# EAGLE board pds019_main_082_ext (EAGLE 9.6.2), part 1 of 2
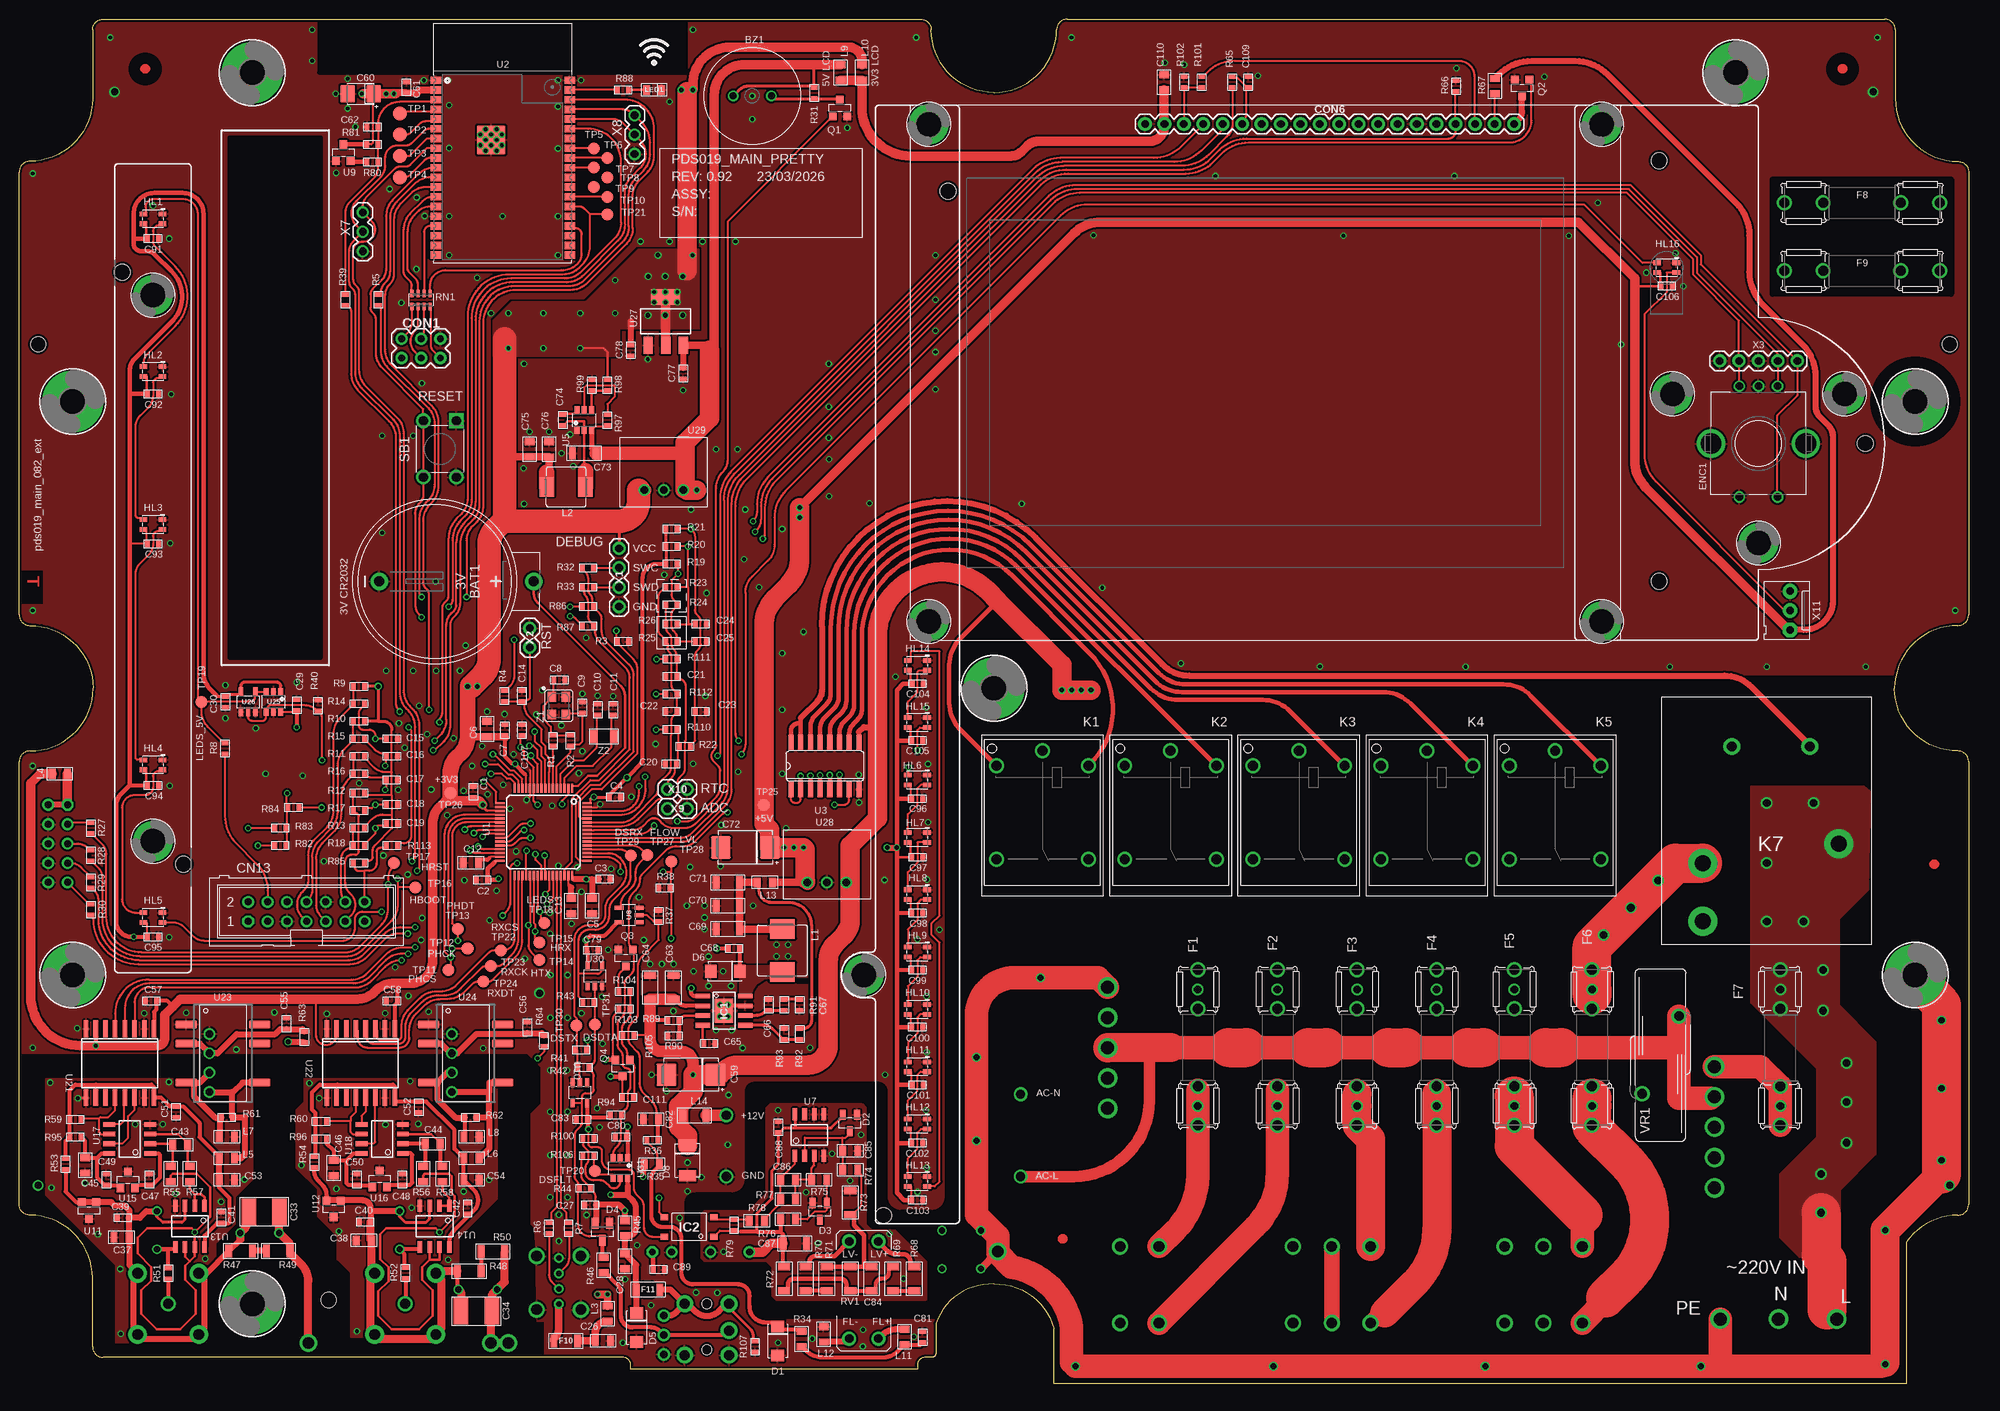
[diagram p7: board, top side]
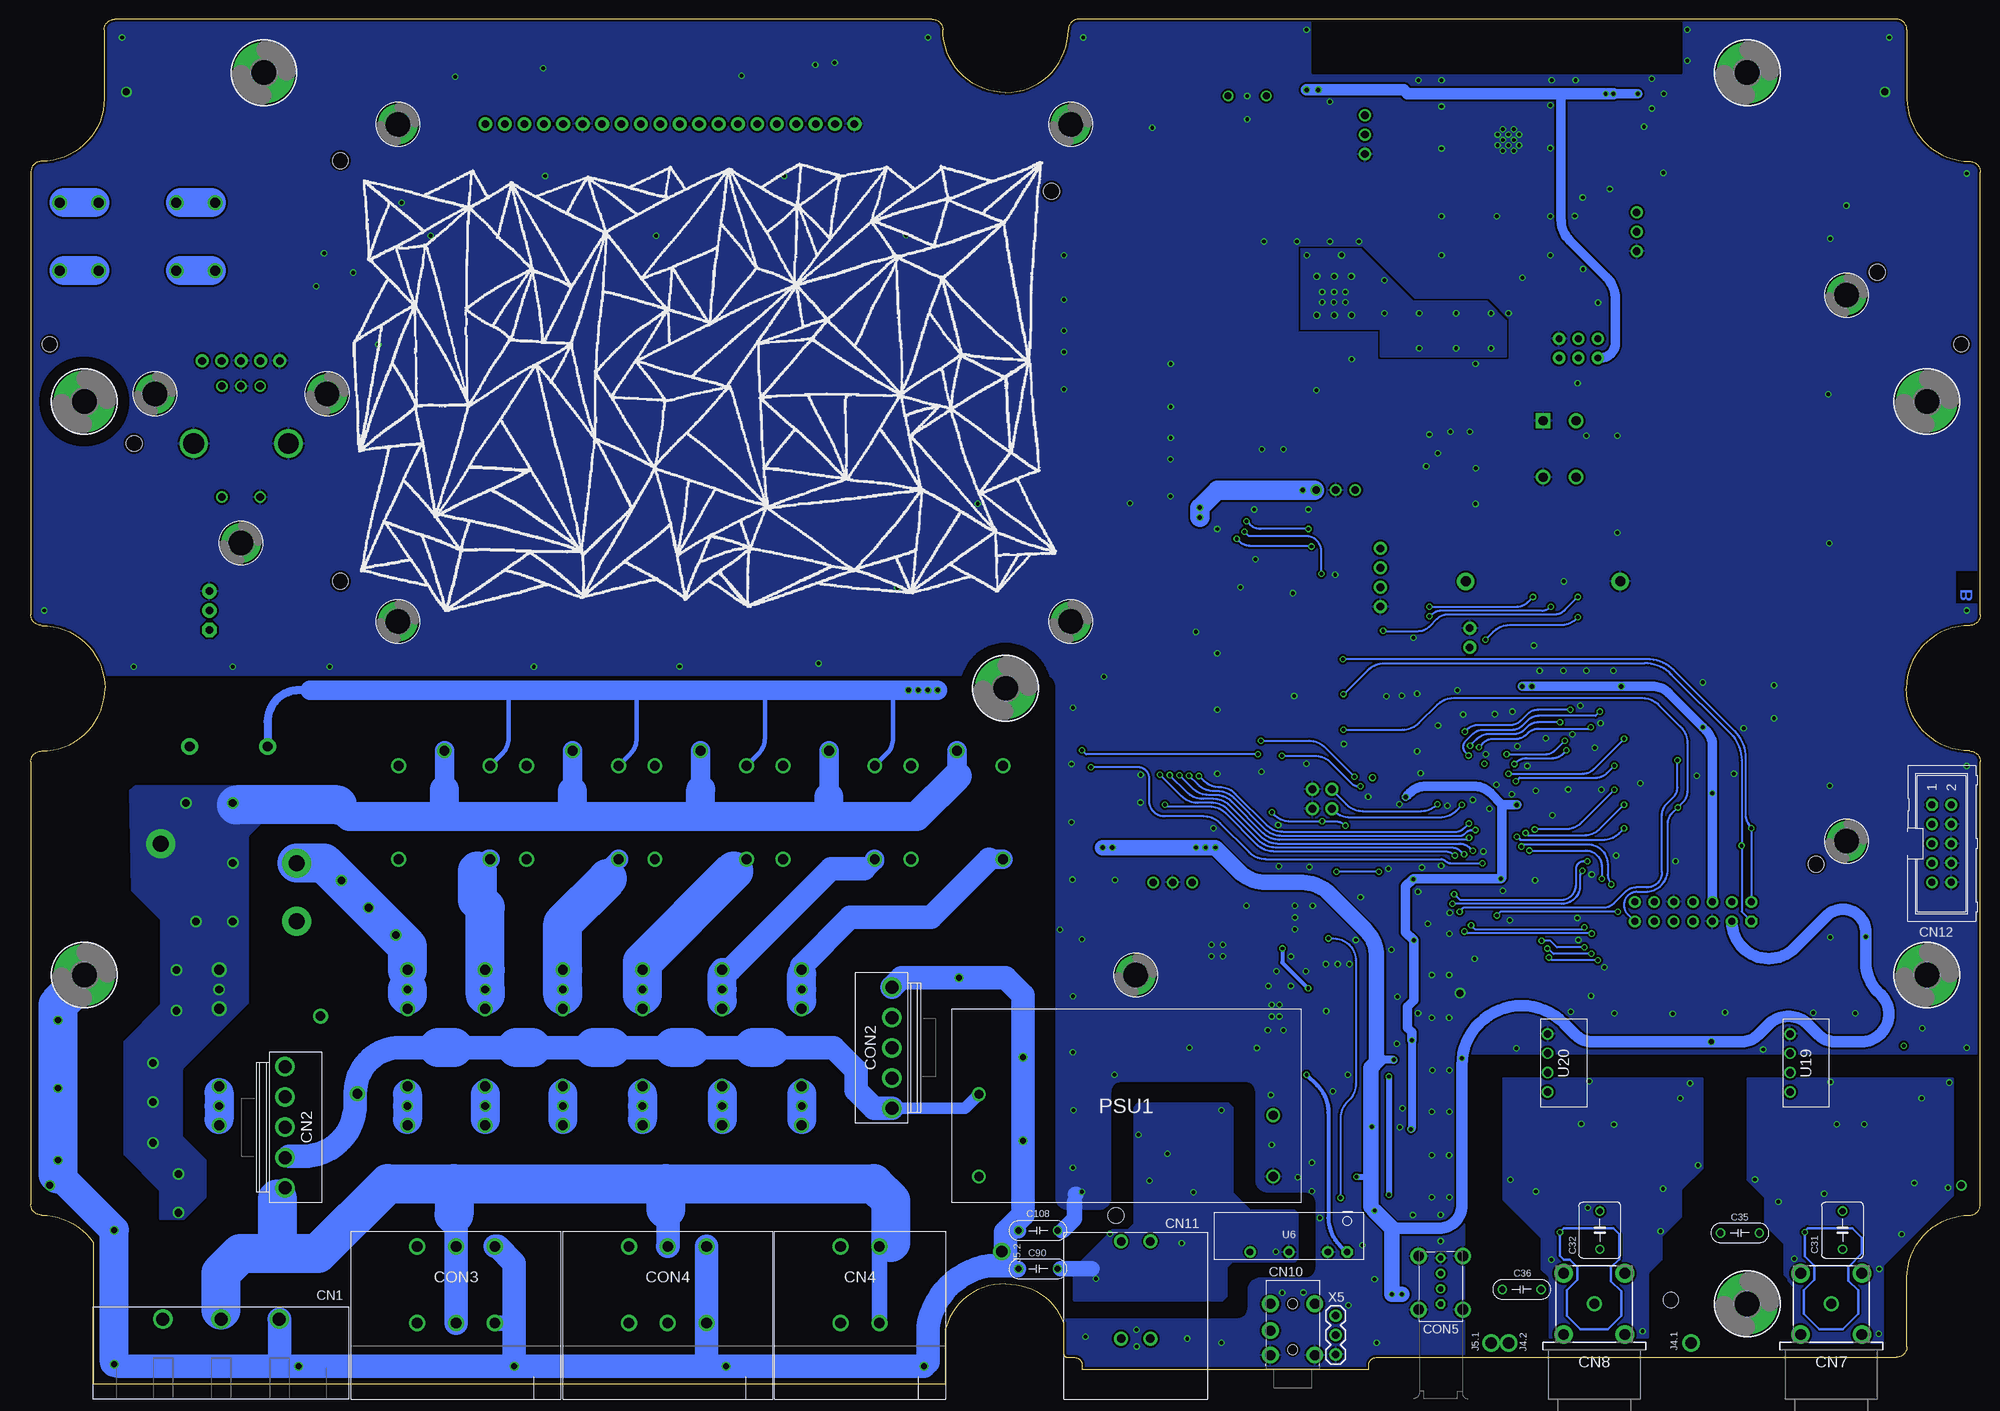
[diagram p8: board, bottom side, seen from below]

Size 255 x 178.45 mm. Coordinates in mm from the lower left corner, seen from the top.
Outline: 11,178.45 117.9,178.45 arc-90 119.3,177.05 arc90 127.5,168.85 arc90 135.7,177.05 arc-90 137.1,178.45 244,178.45 arc-90 245.4,177.05 245.4,168.05 arc90 253.6,159.85 arc-90 255,158.45 255,100.55 arc-90 253.6,99.15 arc90 245.3,90.95 arc90 253.6,82.75 arc-90 255,81.35 255,23.45 arc-90 253.6,22.05 arc56 246.85,18.49 246.85,0 135.35,0 135.35,7.2 arc77 127.5,13.05 arc73 119.9,7.9 119.9,3.95 arc-90 119.4,3.45 118.5,3.45 arc90 117.5,2.45 117.5,1.9 80,1.9 80,2.45 arc90 79,3.45 11,3.45 arc-90 9.6,4.85 9.6,13.85 arc90 1.4,22.05 arc-90 0,23.45 0,81.35 arc-90 1.4,82.75 arc90 9.7,90.95 arc90 1.4,99.15 arc-90 0,100.55 0,158.45 arc-90 1.4,159.85 arc90 9.6,168.05 9.6,177.05 arc-90 11,178.45
Copper layers (1*16): Top 0.035mm / dielectric 1.5mm / Bottom 0.035mm
Design rules "Rezonit 2 layer *": minimum track width 6mil, minimum drill 0.3mm, track to track 0.2mm, track to pad 0.2mm, pad to pad 0.2mm, via to via 0.2mm, smd to smd 0.2mm, copper to edge 0.3mm, drill to drill 6mil, minimum pad ring 0.15mm, minimum via ring 0.15mm, stop-mask expansion 0.05mm, vias tented up to drill 0.51mm, thermal gap 10mil
Net classes: 1 24V: clearance 0.305 mm; 12 Vbat: width 0.229 mm, clearance 0.305 mm
Holes 2.1 mm at 113.05,22 121.5,155.95 214.5,104.95 241.5,122.95 214.5,159.95 21.5,67.95 13.5,145.35
Holes 2 mm at 252.5,135.95 2.5,135.95 40.5,10.95
tRestrict: area 39.2,171.5 to 87.2,178.3; area 242.5,123 to 253.5,133.9; area 27.5,95 to 39.5,162.9; area 100.3,23.7 to 100.8,24.9; area 68.1,44.7 to 69.2,45; area 36.8,45.2 to 37.8,45.5; area 101.7,52.6 to 103.2,52.7; area 101.6,45.7 to 102.6,45.8; 14 lines
bRestrict: area 39.2,171.5 to 87.2,178.3; area 242.5,123 to 253.5,133.9; 1 lines

## Footprints (pad centres in the part's own frame; a part is rotated, then mirrored left to right if it is on the bottom)
CR2032H = drill 1.295 pad 2.286: + 0,13.208; - 0,-6.985
PKM13 = drill 0.914: B+ -2.5,0; B- 2.5,0
C0603 = smd 0.6 x 0.9: 1 -0.725,0; 2 0.725,0
C0805 = smd 0.9 x 1.3: 1 -1,0; 2 1,0
C050-055X072 = drill 0.813: 1 -2.489,0; 2 2.489,0
C1812 = smd 1.9 x 3.45: P$1 -2,0; P$2 2,0
C_5MM = drill 0.813: 1 -2.54,0; 2 2.54,0
CTANT_7X4 = smd 2.591 x 2.896: + -3.2,0; - 3.2,0
CTANT_B = smd 1.88 x 2.286: + -1.702,0; - 1.702,0
C1206 = smd 0.9 x 1.6: P$1 -1.55,0; P$2 1.55,0
2EDGRM-7.62-03P = drill 1.7: 1 -7.62,0; 2 0,0; 3 7.62,0
B5P-VH = drill 1.7: 1 7.92,0; 2 3.96,0; 3 0,0; 4 -3.96,0; 5 -7.92,0
2EDGRHM-5.08-04P = drill 1.4: 1.1 -2.54,-10.008; 1.2 2.54,-10.008; 2.1 -2.54,0; 2.2 2.54,0
BNC_JR_CHN = drill 1.3: 1 0,0 | drill 1.4 pad 2.438: M1 -4,4; M2 4,4; M3 4,-4; M4 -4,-4
ST-033 = drill 1.3 pad 2.184: 1-1 -2.9,0; 1-2 2.9,0; 2-1 -2.9,6.7; 2-2 2.9,6.7; 3 -2.9,3.2 | hole 1.3: 0,0.7; 0,6.7
KF2EDGRHM-3.81-02P = drill 1.1 pad 1.829: 1.1 -1.905,-12.7; 1.2 1.905,-12.7; 2.1 -1.905,0; 2.2 1.905,0
IDC_2X05 = drill 0.914 pad 1.524 octagon: 1 -5.08,-1.27 | drill 0.914 pad 1.524: 2 -5.08,1.27; 3 -2.54,-1.27; 4 -2.54,1.27; 5 0,-1.27; 6 0,1.27; 7 2.54,-1.27; 8 2.54,1.27; 9 5.08,-1.27; 10 5.08,1.27
IDC_2X07 = drill 0.914 pad 1.524 octagon: 1 -7.62,-1.27 | drill 0.914 pad 1.524: 2 -7.62,1.27; 3 -5.08,-1.27; 4 -5.08,1.27; 5 -2.54,-1.27; 6 -2.54,1.27; 7 0,-1.27; 8 0,1.27; 9 2.54,-1.27; 10 2.54,1.27; 11 5.08,-1.27; 12 5.08,1.27; 13 7.62,-1.27; 14 7.62,1.27
2X03-PTH-2.54 = drill 0.9 pad 1.6: 1 -1.27,2.54; 2 1.27,2.54; 3 -1.27,0; 4 1.27,0; 5 -1.27,-2.54; 6 1.27,-2.54
2EDGRHM-5.08-06P = drill 1.4: 1.1 -5.08,-10.008; 1.2 0,-10.008; 1.3 5.08,-10.008; 2.1 -5.08,0; 2.2 0,0; 2.3 5.08,0
KLS1-191-4P-0.7 = drill 0.7 pad 1.219 octagon: 1 0,-0.737 | drill 0.7 pad 1.219: 2 0,-2.718; 3 0,-4.724; 4 0,-6.731 | drill 1.397 pad 2: SH1 -2.896,0; SH2 -2.896,-7.01; SH3 2.896,-7.01; SH4 2.896,0
1X20-PTH-2.54-LONG = drill 1 pad 1.8: 1 -24.13,0; 2 -21.59,0; 3 -19.05,0; 4 -16.51,0; 5 -13.97,0; 6 -11.43,0; 7 -8.89,0; 8 -6.35,0; 9 -3.81,0; 10 -1.27,0; 11 1.27,0; 12 3.81,0; 13 6.35,0; 14 8.89,0; 15 11.43,0; 16 13.97,0; 17 16.51,0; 18 19.05,0; 19 21.59,0; 20 24.13,0
DO-214AC(SMA) = smd 1.5 x 1.7: A -1.9,0; C 1.9,0
SOT23-123 = smd 0.813 x 1.27: 1 -0.94,-1.092; 2 0.94,-1.092; 3 0,1.092
SOT23 = smd 1 x 1.4: 1 -0.95,-1.1; 2 0.95,-1.1; 3 0,1.1
DO-214AA(SMB) = smd 1.5 x 2.2: A -2,0; C 2,0
PEC12R-4XXXF-SXXXX = drill 0.991: 1 -2.5,7; 2 2.5,7; A -2.5,-7.5; B 2.5,-7.5; C 0,-7.5 | drill 2.7: M1 -6.198,0; M2 6.198,0
FC-001S = drill 1.295: 1-1 -10.16,0; 1-2 -5.08,0; 2-1 10.16,0; 2-2 5.08,0
F1206 = smd 0.9 x 1.6: P$1 -1.55,0; P$2 1.55,0
SK6805-2427 = smd 1 x 0.6: 1 1.25,-0.65; 2 1.25,0.65; 3 -1.25,0.65; 4 -1.25,-0.65
SOIC8-POWERPAD = smd 0.6 x 1.9: 1 -1.905,-2.78; 2 -0.635,-2.78; 3 0.635,-2.78; 4 1.905,-2.78; 5 1.905,2.78; 6 0.635,2.78; 7 -0.635,2.78; 8 -1.905,2.78 | smd 3.1 x 2.4: POWERPAD 0,0
-SOP-4 = smd 1 x 0.8: 1 -3.25,1.27; 2 -3.25,-1.27; 3 3.25,-1.27; 4 3.25,1.27
CONN_PAD_1.5 = drill 1.499 pad 2.286: 1 0,0
SRD_UNIV = drill 1.3: 1 -2,0; 2 0,-6; 3 12.2,-6; 5 0,6 | drill 1.295: 4 12.2,6
SLC-12VDC-SL-C = drill 1.3 pad 2.2: C1 -5.1,-12.7; C2 5.1,-12.7 | drill 2.1 pad 3.8: COM -8.9,0; NC 8.9,10.16; NO 8.9,2.54
LSMD_06030 = smd 2.54 x 3.353: 1 -2.794,0; 2 2.794,0
LSMD_05020 = smd 1.981 x 2.489: 1 -2.54,0; 2 2.54,0
R0805 = smd 0.9 x 1.3: 1 -1,0; 2 1,0
R1206 = smd 0.9 x 1.6: P$1 -1.55,0; P$2 1.55,0
LED0805 = smd 0.9 x 1.3: A -1,0; C 1,0
MPAD_3,2_8 = drill 3.2 pad 8.001: 1 0,0
MPAD_3,2_5,5 = drill 3.2 pad 5.182: 1 0,0
IRM-10 = drill 1.2: AC/L 19.25,9.25; AC/N 19.25,-1.5; V+ -19.25,1.25; V- -19.25,9.25
SOT23B-3 = smd 1 x 1: 1 -0.95,-1.1; 2 0.95,-1.1; 3 0,1.1
SOT23' = smd 1 x 1: 1 1.1,-0.95; 2 1.1,0.95; 3 -1.1,0
R0603 = smd 0.6 x 0.9: 1 -0.725,0; 2 0.725,0
RN_YC164 = smd 0.45 x 0.9: 1 -1.2,-0.85; 2 -0.4,-0.85; 3 0.4,-0.85; 4 1.2,-0.85; 5 1.2,0.85; 6 0.4,0.85; 7 -0.4,0.85; 8 -1.2,0.85
SW4-6.0X6.0X5.0MM = drill 1.2 pad 1.905 square: 1 -3.683,2.159 | drill 1.2 pad 1.905: 2 -3.683,-2.159; 3 3.683,-2.159; 4 3.683,2.159
TP18R = smd 1.8 x 1.8: TP 0,0
TP16R = smd 1.6 x 1.6: TP 0,0
TQFP64 = smd 1.2 x 0.3: 1 -5.7,3.75; 2 -5.7,3.25; 3 -5.7,2.75; 4 -5.7,2.25; 5 -5.7,1.75; 6 -5.7,1.25; 7 -5.7,0.75; 8 -5.7,0.25; 9 -5.7,-0.25; 10 -5.7,-0.75; 11 -5.7,-1.25; 12 -5.7,-1.75; 13 -5.7,-2.25; 14 -5.7,-2.75; 15 -5.7,-3.25; 16 -5.7,-3.75; 33 5.7,-3.75; 34 5.7,-3.25; 35 5.7,-2.75; 36 5.7,-2.25; 37 5.7,-1.75; 38 5.7,-1.25; 39 5.7,-0.75; 40 5.7,-0.25; 41 5.7,0.25; 42 5.7,0.75; 43 5.7,1.25; 44 5.7,1.75; 45 5.7,2.25; 46 5.7,2.75; 47 5.7,3.25; 48 5.7,3.75 | smd 0.3 x 1.2: 17 -3.75,-5.7; 18 -3.25,-5.7; 19 -2.75,-5.7; 20 -2.25,-5.7; 21 -1.75,-5.7; 22 -1.25,-5.7; 23 -0.75,-5.7; 24 -0.25,-5.7; 25 0.25,-5.7; 26 0.75,-5.7; 27 1.25,-5.7; 28 1.75,-5.7; 29 2.25,-5.7; 30 2.75,-5.7; 31 3.25,-5.7; 32 3.75,-5.7; 49 3.75,5.7; 50 3.25,5.7; 51 2.75,5.7; 52 2.25,5.7; 53 1.75,5.7; 54 1.25,5.7; 55 0.75,5.7; 56 0.25,5.7; 57 -0.25,5.7; 58 -0.75,5.7; 59 -1.25,5.7; 60 -1.75,5.7; 61 -2.25,5.7; 62 -2.75,5.7; 63 -3.25,5.7; 64 -3.75,5.7
ESP32-WROVER-E = smd 1.473 x 0.914: 1 -8.763,8.255; 2 -8.763,6.985; 3 -8.763,5.715; 4 -8.763,4.445; 5 -8.763,3.175; 6 -8.763,1.905; 7 -8.763,0.635; 8 -8.763,-0.635; 9 -8.763,-1.905; 10 -8.763,-3.175; 11 -8.763,-4.445; 12 -8.763,-5.715; 13 -8.763,-6.985; 14 -8.763,-8.255; 15 -8.763,-9.525; 16 -8.763,-10.795; 17 -8.763,-12.065; 18 -8.763,-13.335; 19 -8.763,-14.605; 20 8.763,-14.605; 21 8.763,-13.335; 22 8.763,-12.065; 23 8.763,-10.795; 24 8.763,-9.525; 25 8.763,-8.255; 26 8.763,-6.985; 27 8.763,-5.715; 28 8.763,-4.445; 29 8.763,-3.175; 30 8.763,-1.905; 31 8.763,-0.635; 32 8.763,0.635; 33 8.763,1.905; 34 8.763,3.175; 35 8.763,4.445; 36 8.763,5.715; 37 8.763,6.985; 38 8.763,8.255 | smd 3.75 x 3.75: 39 -1.5,0.455
SO16 = smd 2.032 x 0.66: 1 -3.073,4.445; 2 -3.073,3.175; 3 -3.073,1.905; 4 -3.073,0.635; 5 -3.073,-0.635; 6 -3.073,-1.905; 7 -3.073,-3.175; 8 -3.073,-4.445; 9 3.073,-4.445; 10 3.073,-3.175; 11 3.073,-1.905; 12 3.073,-0.635; 13 3.073,0.635; 14 3.073,1.905; 15 3.073,3.175; 16 3.073,4.445
SOT23-6 = smd 1 x 0.65: 1 1.3,-0.95; 2 1.3,0; 3 1.3,0.95; 4 -1.3,0.95; 5 -1.3,0; 6 -1.3,-0.95
SIP7_6X19.65_SINGLE = drill 0.9 pad 1.473 octagon: 1 -7.62,0 | drill 0.9 pad 1.473: 2 -5.08,0; 4 0,0; 6 5.08,0
SOIC8 = smd 0.6 x 1.55: 1 -1.905,-2.7; 2 -0.635,-2.7; 3 0.635,-2.7; 4 1.905,-2.7; 5 1.905,2.7; 6 0.635,2.7; 7 -0.635,2.7; 8 -1.905,2.7
SOT23-5 = smd 1.2 x 0.55: 1 1.3,-0.95; 2 1.3,0; 3 1.3,0.95; 4 -1.3,0.95; 5 -1.3,-0.95
SIP-4 = drill 1 pad 1.5: 1 -3.81,-2.1; 2 -1.27,-2.1; 3 1.27,-2.1; 4 3.81,-2.1
SO-16W = smd 2.2 x 0.6: 1 -4.5,4.445; 2 -4.5,3.175; 3 -4.5,1.905; 4 -4.5,0.635; 5 -4.5,-0.635; 6 -4.5,-1.905; 7 -4.5,-3.175; 8 -4.5,-4.445; 9 4.5,-4.445; 10 4.5,-3.175; 11 4.5,-1.905; 12 4.5,-0.635; 13 4.5,0.635; 14 4.5,1.905; 15 4.5,3.175; 16 4.5,4.445
PSDV_ELF_2 = smd 1.016 x 2.794: 1 -3.81,-4.826; 2 -1.27,-4.826; 4 3.81,-4.826; 5 3.81,4.826; 7 -1.27,4.826; 8 -3.81,4.826
SOT-223 = smd 1.219 x 2.235: 1 -2.3,-3.15; 2 0,-3.15; 3 2.3,-3.15 | smd 3.8 x 2: 4 0,3.15
K78XX-1000R3_V = drill 1: 1 -2.54,0; 2 0,0; 3 2.54,0
S20K420 = drill 1.27 pad 1.981: 1 -2.413,-5.08; 2 2.413,5.08
1X04-PTH-2.54 = drill 1 pad 1.7: 1 -3.81,0; 2 -1.27,0; 3 1.27,0; 4 3.81,0
1X02-PTH-2.54 = drill 1 pad 1.7: 1 -1.27,0; 2 1.27,0
1X05-PTH-2.54 = drill 1 pad 1.7: 1 -5.08,0; 2 -2.54,0; 3 0,0; 4 2.54,0; 5 5.08,0
1X03-PTH-2.54 = drill 1 pad 1.6: 1 -2.54,0; 2 0,0; 3 2.54,0
KF2510-03 = drill 1 pad 1.93 octagon: 1 2.54,0 | drill 1 pad 1.93: 2 0,0; 3 -2.54,0
OSCILLATOR-3.2X2.5-4P = smd 1.3 x 1.1: 1 -1.15,-0.9; 2 1.15,-0.9; 3 1.15,0.9; 4 -1.15,0.9
32X15 = smd 1 x 1.6: P$1 -1.3,0; P$2 1.3,0

## Placement (x,y rotation side)
BAT1  BATTERY-L-KLS5-CR2032-01  [CR2032H]  54.09,104.92 270 top
BOX1  [BOX_G3783MF-IP67_MM]  127.5,90.95 0 top
BZ1  PKM13  [PKM13]  95.89,168.4 0 top
C1  0,1  [C0603]  59.4,77.41 90 top
C2  0,1  [C0603]  60.55,65.88 180 top
C3  0,1  [C0603]  76.57,65.98 0 top
C4  0,1  [C0603]  77.94,76.73 0 top
C5  10uF  [C0805]  74.92,62.5 270 top
C6  10uF  [C0805]  61.21,85.62 90 top
C7  0,1  [C0603]  63.54,85.46 90 top
C8  20pF  [C0603]  70.65,92.04 180 top
C9  20pF  [C0603]  73.68,88.44 270 top
C10  6,8pF  [C0603]  75.68,88.16 90 top
C11  6,8pF  [C0603]  77.72,88.16 90 top
C12  2,2uF  [C0805]  59.1,68.12 180 top
C13  2,2uF  [C0805]  72.23,62.48 270 top
C14  0,1  [C0603]  65.78,89.93 270 top
C15  0,1  [C0603]  48.76,84.35 0 top
C16  0,1  [C0603]  48.76,82.06 0 top
C17  0,1  [C0603]  48.73,78.96 0 top
C18  0,1  [C0603]  48.76,75.74 0 top
C19  0,1  [C0603]  48.76,73.25 0 top
C20  0,1  [C0603]  85.23,81.04 180 top
C21  0,1  [C0603]  85.34,92.47 180 top
C22  0,1  [C0603]  85.34,87.9 180 top
C23  NC  [C0603]  89.15,87.9 0 top
C24  NC  [C0603]  89.15,99.33 0 top
C25  NC  [C0603]  89.15,97.05 0 top
C26  22uF  [C0805]  76.37,5.61 0 top
C27  0,1  [C0603]  74.69,23.39 180 top
C28  22uF  [C0805]  79.24,16.02 270 top
C29  NC  [C0603]  36.31,88.74 90 top
C30  0,1  [C0603]  26.99,89.17 270 top
C31  0,01 100V FKP2  [C050-055X072]  18.03,20.08 90 bottom
C32  0,01 100V FKP2  [C050-055X072]  49.78,20.08 90 bottom
C33  NC  [C1812]  32.07,22.47 0 top
C34  NC  [C1812]  59.81,9.49 0 top
C35  1000pF  [C_5MM]  31.46,19.73 180 bottom
C36  1000pF  [C_5MM]  59.99,12.34 180 bottom
C37  10uF  [C0805]  13.4,19.14 180 top
C38  10uF  [C0805]  45.1,18.74 180 top
C39  0,1  [C0603]  13.56,21.71 180 top
C40  0,1  [C0603]  45.25,21.18 180 top
C41  0,1  [C0603]  26.46,21.73 90 top
C42  0,1  [C0603]  58.67,22.93 90 top
C43  1uF  [C0805]  21.07,31.26 0 top
C44  1uF  [C0805]  54.09,31.39 0 top
C45  10uF  [C0805]  8.63,28.57 270 top
C46  10uF  [C0805]  41.14,28.21 270 top
C47  0,1  [C0603]  17.04,26.71 90 top
C48  0,1  [C0603]  50.16,26.71 90 top
C49  0,1  [C0603]  11.42,26.69 90 top
C50  0,1  [C0603]  44.19,26.71 90 top
C51  0,1  [C0603]  20.54,35.55 270 top
C52  0,1  [C0603]  52.27,36.16 270 top
C53  22,0  [C0805]  27.17,26.69 0 top
C54  22,0  [C0805]  59.17,26.69 0 top
C55  10uF  [C0603]  34.97,47.08 90 top
C56  10uF  [C0603]  66.46,46.58 90 top
C57  0,1  [C0603]  17.26,50.06 180 top
C58  0,1  [C0603]  48.76,50.06 180 top
C59  100,0  [CTANT_7X4]  87.88,40.4 180 top
C60  100,0  [CTANT_B]  44.7,168.67 180 top
C61  0,1  [C0603]  50.67,169.54 270 top
C62  0,1  [C0603]  46.22,164.36 0 top
C63  10uF 50V  [C1206]  85.59,51.83 270 top
C64  10uF 50V  [C1206]  82.54,51.83 270 top
C65  0,01  [C0603]  90.26,44.49 180 top
C66  10pF  [C0603]  98.04,49.55 270 top
C67  2n2  [C0603]  102.1,49.55 90 top
C68  0,1  [C0603]  93.51,56.91 0 top
C69  22uF 16V  [C1206]  92.7,59.45 0 top
C70  22uF 16V  [C1206]  92.7,62.5 0 top
C71  NC  [C1206]  92.7,65.55 0 top
C72  150,0  [CTANT_7X4]  94.99,70.12 180 top
C73  22,0 16V  [C1206]  73.91,121.68 0 top
C74  0,1  [C0603]  71.11,126.03 270 top
C75  22,0 16V  [C0805]  66.79,122.19 270 top
C76  22,0 16V  [C0805]  69.33,122.19 270 top
C77  0,1  [C0603]  86.86,132.1 270 top
C78  0,1  [C0603]  80,135.15 270 top
C79  0,1  [C0603]  74.97,56.69 0 top
C80  0,1  [C0603]  78.71,32.28 180 top
C81  0,1  [C0603]  118.18,6.09 90 top
C82  1uF  [C0805]  82.64,34.61 180 top
C83  0,1  [C0603]  73.6,34.54 180 top
C84  4,7uF  [C1206]  111.5,13.73 90 top
C85  1uF  [C0805]  108.7,30.5 180 top
C86  220pF  [C0805]  100.58,26.69 180 top
C87  10uF 50V  [C1206]  101.47,18.36 0 top
C88  0,1  [C0603]  99.31,33.55 90 top
C89  0,1  [C0603]  83.66,14.93 0 top
C90  4700pF  [C_5MM]  123.26,15.03 180 bottom
C91  0,1  [C0603]  17.52,149.75 0 top
C92  0,1  [C0603]  17.52,129.43 0 top
C93  0,1  [C0603]  17.52,109.82 0 top
C94  0,1  [C0603]  17.52,78.25 0 top
C95  0,1  [C0603]  17.52,58.44 0 top
C96  0,1  [C0603]  117.47,76.5 0 top
C97  0,1  [C0603]  117.49,68.85 0 top
C98  0,1  [C0603]  117.49,61.56 0 top
C99  0,1  [C0603]  117.49,54.12 0 top
C100  0,1  [C0603]  117.47,46.63 0 top
C101  0,1  [C0603]  117.52,39.08 0 top
C102  0,1  [C0603]  117.49,31.49 0 top
C103  0,1  [C0603]  117.47,24.02 0 top
C104  0,1  [C0603]  117.52,91.53 0 top
C105  0,1  [C0603]  117.49,84.09 0 top
C106  0,1  [C0603]  215.51,143.53 0 top
C107  0,1  [C0603]  65.78,85.46 270 top
C108  4700pF  [C_5MM]  123.26,20.03 0 bottom
C109  33pF  [C0603]  160.77,170.2 90 top
C110  10uF  [C0805]  149.78,170.2 90 top
C111  NC  [C0603]  79.65,37.46 0 top
CN1  2EDGRM-7.62-03P  [2EDGRM-7.62-03P]  230.12,8.45 0 bottom
CN2  CON-5P-JST-VH  [B5P-VH]  221.73,33.55 90 bottom
CN4  CON-2X2  [2EDGRHM-5.08-04P]  146.55,17.95 0 bottom
CN7  RF_CONNECTOR-BNC-KY-WE  [BNC_JR_CHN]  19.5,10.45 180 bottom
CN8  RF_CONNECTOR-BNC-KY-WE  [BNC_JR_CHN]  50.5,10.45 180 bottom
CN10  ST-033  [ST-033]  89.96,3.75 0 bottom
CN11  KF2-EDGRHM-3.81-02P  [KF2EDGRHM-3.81-02P]  110.48,18.61 0 bottom
CN12  BH-10  [IDC_2X05]  5.07,70.63 270 bottom
CN13  BH14  [IDC_2X07]  37.58,61.74 0 top
CON1  PINHEAD_2X03-PTH-2.54  [2X03-PTH-2.54]  52.57,135.4 90 top
CON2  CON-5P-JST-VH  [B5P-VH]  142.36,43.93 270 bottom
CON3  CON-2X3  [2EDGRHM-5.08-06P]  199.38,17.95 0 bottom
CON4  CON-2X3  [2EDGRHM-5.08-06P]  171.7,17.95 0 bottom
CON5  USB-A-KLS1-191  [KLS1-191-4P-0.7]  70.58,9.7 180 bottom
CON6  PINHEAD_1X20-2.54-MALE-LONG  [1X20-PTH-2.54-LONG]  171.4,164.75 0 top
COVER1  [PDS019_COVER_SW_LED]  17.5,96.65 0 top
COVER2  [PDS019_COVER_LEDS]  117.5,93.95 0 top
COVER3  [PDS019_COVER_ENC]  227.5,122.95 0 top
D1  SMAJ5.0A  [DO-214AC(SMA)]  99.23,5.61 90 top
D2  BAV23S  [SOT23-123]  108.65,34.1 180 top
D3  BAV23S  [SOT23-123]  104.72,22.55 180 top
D4  BAT54S  [SOT23]  76.29,19.88 180 top
D5  SMAJ5.0A  [DO-214AC(SMA)]  80.76,7.36 90 top
D6  SK34  [DO-214AC(SMA)]  92.35,53.94 0 top
D8  SMBJ15A  [DO-214AA(SMB)]  87.42,29.2 90 top
ENC1  PEC12R-4XXXF-S  [PEC12R-4XXXF-SXXXX]  227.5,122.95 180 top
F1  1A  [FC-001S]  154.17,43.96 270 top
F2  1A  [FC-001S]  164.58,43.96 270 top
F3  1A  [FC-001S]  175,43.96 270 top
F4  1A  [FC-001S]  185.41,43.96 270 top
F5  1A  [FC-001S]  195.57,43.96 270 top
F6  1A  [FC-001S]  205.73,43.96 270 top
F7  1A  [FC-001S]  230.37,43.96 90 top
F8  1A  [FC-001S]  241.04,154.45 0 top
F9  1A  [FC-001S]  241.04,145.56 0 top
F10  FUSE-1206  [F1206]  71.49,5.61 0 top
F11  NC  [F1206]  82.26,12.31 0 top
HL1  SK6805-2427  [SK6805-2427]  17.52,152.34 0 top
HL2  SK6805-2427  [SK6805-2427]  17.52,132.35 0 top
HL3  SK6805-2427  [SK6805-2427]  17.5,112.35 0 top
HL4  SK6805-2427  [SK6805-2427]  17.52,80.94 0 top
HL5  SK6805-2427  [SK6805-2427]  17.52,60.95 0 top
HL6  SK6805-2427  [SK6805-2427]  117.5,78.95 0 top
HL7  SK6805-2427  [SK6805-2427]  117.5,71.45 0 top
HL8  SK6805-2427  [SK6805-2427]  117.5,63.95 0 top
HL9  SK6805-2427  [SK6805-2427]  117.5,56.45 0 top
HL10  SK6805-2427  [SK6805-2427]  117.5,48.95 0 top
HL11  SK6805-2427  [SK6805-2427]  117.5,41.45 0 top
HL12  SK6805-2427  [SK6805-2427]  117.5,33.95 0 top
HL13  SK6805-2427  [SK6805-2427]  117.5,26.45 0 top
HL14  SK6805-2427  [SK6805-2427]  117.5,93.95 0 top
HL15  SK6805-2427  [SK6805-2427]  117.5,86.45 0 top
HL16  SK6805-2427  [SK6805-2427]  215.51,145.94 0 top
IC1  TPS54231  [SOIC8-POWERPAD]  92.19,48.79 270 top
IC2  KPC357NT-SOP-4  [-SOP-4]  87.62,20.49 180 top
J4.1  CONN_PAD-1,5R  [CONN_PAD_1.5]  37.84,5.35 0 bottom
J4.2  CONN_PAD-1,5R  [CONN_PAD_1.5]  61.71,5.35 0 bottom
J5.1  CONN_PAD-1,5R  [CONN_PAD_1.5]  64,5.35 0 bottom
J5.2  CONN_PAD-1,5R  [CONN_PAD_1.5]  128.01,17.29 0 bottom
K1  HLS8-22F-DC12V-C  [SRD_UNIV]  133.85,80.79 270 top
K2  HLS8-22F-DC12V-C  [SRD_UNIV]  150.61,80.79 270 top
K3  HLS8-22F-DC12V-C  [SRD_UNIV]  167.38,80.79 270 top
K4  HLS8-22F-DC12V-C  [SRD_UNIV]  184.14,80.79 270 top
K5  HLS8-22F-DC12V-C  [SRD_UNIV]  200.91,80.79 270 top
K7  SRD-SLC  [SLC-12VDC-SL-C]  229.1,70.63 180 top
L1  22uH  [LSMD_06030]  99.81,56.66 90 top
L2  3.3uH  [LSMD_05020]  71.54,117.26 180 top
L3  600R  [R0805]  76.95,9.16 270 top
L4  600R  [R0805]  5.33,79.77 0 top
L5  600R  [R0805]  27.17,29.48 0 top
L6  600R  [R0805]  59.17,29.48 0 top
L7  600R  [R0805]  27.17,32.28 180 top
L8  600R  [R0805]  59.17,32.28 180 top
L9  600R  [R0805]  107.43,171.47 90 top
L10  NC  [R0805]  110.23,171.47 90 top
L11  600R  [R0805]  115.82,6.14 270 top
L12  600R  [R0805]  105.25,6.47 90 top
L13  600R  [R0805]  97.53,65.55 0 top
L14  0R  [R1206]  88.31,35.1 180 top
LED1  LED-0805  [LED0805]  83.05,169.18 0 top
M1  MPAD3,2-8  [MPAD_3,2_8]  127.5,90.95 0 top
M2  MPAD3,2-8  [MPAD_3,2_8]  7,128.45 0 top
M3  MPAD3,2-8  [MPAD_3,2_8]  7,53.45 0 top
M4  MPAD3,2-8  [MPAD_3,2_8]  248,128.45 0 top
M5  MPAD3,2-8  [MPAD_3,2_8]  248,53.45 0 top
M7  MPAD3,2-8  [MPAD_3,2_8]  30.5,171.45 0 top
M8  MPAD3,2-8  [MPAD_3,2_8]  224.5,171.45 0 top
M9  MPAD3,2-8  [MPAD_3,2_8]  30.5,10.45 0 top
M10  MPAD3,2-5,5  [MPAD_3,2_5,5]  216.24,129.45 0 top
M11  MPAD3,2-5,5  [MPAD_3,2_5,5]  238.76,129.45 0 top
M12  MPAD3,2-5,5  [MPAD_3,2_5,5]  227.5,109.95 0 top
M13  MPAD3,2-5,5  [MPAD_3,2_5,5]  17.5,142.35 0 top
M14  MPAD3,2-5,5  [MPAD_3,2_5,5]  17.5,70.95 0 top
M17  MPAD3,2-5,5  [MPAD_3,2_5,5]  119,164.7 0 top
M18  MPAD3,2-5,5  [MPAD_3,2_5,5]  207,164.7 0 top
M19  MPAD3,2-5,5  [MPAD_3,2_5,5]  207,99.7 0 top
M20  MPAD3,2-5,5  [MPAD_3,2_5,5]  119,99.7 0 top
M21  MPAD3,2-5,5  [MPAD_3,2_5,5]  110.5,53.45 0 top
PSU1  IRM-10-12  [IRM-10]  111.75,36.35 180 bottom
Q1  NC  [SOT23B-3]  107.36,166.82 0 top
Q2  BCR133  [SOT23B-3]  196.59,169.44 180 top
Q3  NC  [SOT23B-3]  79.34,55.67 180 top
Q4  NC  [SOT23']  78.94,41.27 90 top
R1  33R  [R0603]  69.84,84.09 90 top
R2  1M  [R0603]  72.13,84.09 270 top
R3  10K  [R0603]  78.99,97.05 180 top
R4  33R  [R0603]  63.49,89.93 270 top
R5  33R  [R0603]  46.98,141.75 270 top
R6  22R  [R0603]  69.31,20.34 270 top
R7  22R  [R0603]  71.87,20.34 270 top
R8  NC  [R0603]  26.92,83.08 270 top
R9  2,7K  [R0603]  44.44,91.2 0 top
R10  2,7K  [R0603]  44.44,86.63 0 top
R11  2,7K  [R0603]  44.44,82.06 0 top
R12  2,7K  [R0603]  44.44,77.23 0 top
R13  2,7K  [R0603]  44.44,72.66 0 top
R14  8,2K  [R0603]  44.44,88.92 180 top
R15  8,2K  [R0603]  44.44,84.35 180 top
R16  8,2K  [R0603]  44.44,79.77 180 top
R17  8,2K  [R0603]  44.44,74.95 180 top
R18  8,2K  [R0603]  44.44,70.38 180 top
R19  NC  [R0603]  85.34,107.21 180 top
R20  NC  [R0603]  85.34,109.49 180 top
R21  NC  [R0603]  85.34,111.78 180 top
R22  NC  [R0603]  87.06,83.33 0 top
R23  NC  [R0603]  85.34,104.16 0 top
R24  NC  [R0603]  85.34,101.87 0 top
R25  NC  [R0603]  85.34,97.05 0 top
R26  NC  [R0603]  85.34,99.33 0 top
R27  22R  [R0603]  9.39,72.66 90 top
R28  22R  [R0603]  9.39,69.11 90 top
R29  33R  [R0603]  9.39,65.55 90 top
R30  100R  [R0603]  9.39,61.99 90 top
R31  NC  [R0603]  104,168.78 90 top
R32  43R  [R0603]  74.41,106.7 180 top
R33  43R  [R0603]  74.41,104.16 180 top
R34  56R  [R0805]  102.35,5.86 90 top
R35  560R  [R0805]  82.75,28.69 180 top
R36  15K  [R0603]  82.82,31.84 0 top
R37  47K  [R0603]  83.66,61.18 270 top
R38  2,7K  [R0603]  84.42,64.84 0 top
R39  100R  [R0603]  42.66,141.75 90 top
R40  47K  [R0603]  39.11,88.66 270 top
R41  47K  [R0603]  73.5,43.66 0 top
R42  NC  [R0603]  73.83,41.34 0 top
R43  NC  [R0603]  74.44,49.88 180 top
R44  1,8K  [R0603]  74.01,25.57 0 top
R45  NC  [R0805]  79.24,20.34 270 top
R46  56R  [R0805]  76.45,15.51 270 top
R47  1M  [R1206]  28.97,17.37 0 top
R48  1M  [R1206]  58.87,14.72 0 top
R49  1M  [R1206]  33.9,17.37 0 top
R50  1M  [R1206]  61.97,17.29 0 top
R51  200K  [R0603]  19.52,14.45 90 top
R52  200K  [R0603]  50.54,14.5 90 top
R53  470R  [R0603]  6.09,28.72 270 top
R54  470R  [R0603]  38.6,28.97 270 top
R55  1K00  [R0805]  19.8,27.45 270 top
R56  1K00  [R0805]  52.82,27.45 90 top
R57  1K00  [R0805]  22.34,27.45 270 top
R58  1K00  [R0805]  55.36,27.45 270 top
R59  10K  [R0603]  7.36,34.56 180 top
R60  10K  [R0603]  39.46,34.31 180 top
R61  680R*  [R0603]  27.17,34.82 0 top
R62  680R*  [R0603]  59.02,34.82 0 top
R63  10R  [R0603]  37.3,45.36 270 top
R64  10R  [R0603]  68.65,44.85 270 top
R65  33R  [R0603]  158.67,170.2 90 top
R66  15K  [R0603]  187.95,169.69 270 top
R67  22R  [R0805]  193.03,169.69 90 top
R68  220R  [R1206]  117.09,13.73 270 top
R69  220R  [R1206]  114.29,13.73 90 top
R70  220R  [R1206]  102.86,13.73 270 top
R71  220R  [R1206]  105.66,13.73 90 top
R72  86R6  [R1206]  100.07,13.73 90 top
R73  86R6  [R1206]  108.7,23.69 270 top
R74  10,0K  [R0805]  108.7,27.96 0 top
R75  10,0K  [R0805]  104.64,26.69 0 top
R76  47K  [R0805]  100.58,21.51 180 top
R77  2M  [R0805]  100.58,24.15 0 top
R78  4,7K  [R0805]  96.49,21.33 0 top
R79  1K  [R0603]  93.51,20.74 270 top
R80  10K  [R0603]  46.22,159.78 0 top
R81  NC  [R0603]  46.22,162.07 180 top
R82  2,7K  [R0603]  34.16,70.38 0 top
R83  2,7K  [R0603]  34.16,72.66 0 top
R84  2,7K  [R0603]  35.88,75.35 180 top
R85  2,7K  [R0603]  44.44,68.09 0 top
R86  33R  [R0603]  74.41,101.62 0 top
R87  33R  [R0603]  74.41,99.08 0 top
R88  1,5K  [R0603]  78.99,169.18 0 top
R89  169K  [R0603]  85.59,47.52 0 top
R90  44,2K  [R0603]  85.59,45.48 180 top
R91  18,2K  [R0603]  100.07,49.55 90 top
R92  10,2K  [R0603]  102.1,45.74 270 top
R93  1,96K  [R0603]  100.07,45.74 90 top
R94  47K  [R0603]  78.05,35.12 180 top
R95  43R  [R0603]  7.36,32.28 180 top
R96  43R  [R0603]  39.46,32.02 0 top
R97  100K  [R0603]  76.95,126 270 top
R98  33,2K  [R0603]  76.95,130.57 270 top
R99  10,0K  [R0603]  74.92,130.57 90 top
R100  220K  [R0603]  74.46,32.07 180 top
R101  NC  [R0603]  154.68,170.2 90 top
R102  NC  [R0603]  152.39,170.2 90 top
R103  NC  [R0603]  79.16,48.99 180 top
R104  NC  [R0603]  79.16,51.3 0 top
R105  NC  [R0603]  79.7,45.56 0 top
R106  NC  [R0603]  74.46,29.81 0 top
R107  1K  [R0603]  96.26,4.84 90 top
R110  8,2K  [R0603]  85.34,85.54 180 top
R111  8,2K  [R0603]  85.34,94.76 180 top
R112  8,2K  [R0603]  85.34,90.19 180 top
R113  8,2K  [R0603]  48.76,70.38 180 top
REP1  [REF_POINT_D1.27_D3.81]  16.5,171.95 0 top
REP2  [REF_POINT_D1.27_D3.81]  238.5,171.95 0 top
REP3  [REF_POINT_D1.27_D3.81]  250.5,67.95 0 top
REP4  [REF_POINT_D1.27_D3.81]  136.5,18.95 0 top
RN1  100R  [RN_YC164]  52.57,141.75 0 top
RV1  26V  [R1206]  108.7,13.73 270 top
SB1  KLS7-TS6601-4,3-180  [SW4-6.0X6.0X5.0MM]  55.03,122.24 270 top
TP1  TPTP18R  [TP18R]  49.78,166.13 90 top
TP2  TPTP18R  [TP18R]  49.78,163.34 0 top
TP3  TPTP18R  [TP18R]  49.78,160.55 0 top
TP4  TPTP18R  [TP18R]  49.78,157.75 0 top
TP5  TPTP16R  [TP16R]  75.18,161.56 90 top
TP6  TPTP16R  [TP16R]  76.95,160.29 90 top
TP7  TPTP16R  [TP16R]  75.18,159.02 90 top
TP8  TPTP16R  [TP16R]  76.95,157.75 90 top
TP9  TPTP16R  [TP16R]  75.18,156.48 90 top
TP10  TPTP16R  [TP16R]  76.95,155.21 90 top
TP11  TPTP16R  [TP16R]  56.13,54.12 0 top
TP12  TPTP16R  [TP16R]  58.67,56.91 0 top
TP13  TPTP16R  [TP16R]  57.4,59.45 0 top
TP14  TPTP16R  [TP16R]  68.06,55.39 0 top
TP15  TPTP16R  [TP16R]  68.06,57.68 0 top
TP16  TPTP16R  [TP16R]  51.86,64.92 0 top
TP17  TPTP16R  [TP16R]  49.01,68.09 0 top
TP18  TPTP16R  [TP16R]  68.7,60.25 0 top
TP19  TPTP16R  [TP16R]  23.87,89.17 0 top
TP20  TPTP16R  [TP16R]  75.33,27.81 0 top
TP21  TPTP16R  [TP16R]  76.95,152.93 0 top
TP22  TPTP16R  [TP16R]  62.98,56.66 0 top
TP23  TPTP16R  [TP16R]  61.71,54.63 0 top
TP24  TPTP16R  [TP16R]  60.7,52.6 0 top
TP25  TPTP16R  [TP16R]  97.43,75.71 0 top
TP26  TPTP16R  [TP16R]  56.38,77.23 0 top
TP27  TPTP16R  [TP16R]  82.16,69.13 0 top
TP28  TPTP16R  [TP16R]  85.31,68.29 0 top
TP29  TPTP16R  [TP16R]  80,69.11 0 top
TP30  TPTP16R  [TP16R]  72.92,46.83 0 top
TP31  TPTP16R  [TP16R]  75.3,47.01 90 top
U1  STM32F2xxR  [TQFP64]  68.57,72.15 270 top
U2  ESP32-WROVER-(I)E  [ESP32-WROVER-E]  63.25,162.2 0 top
U3  ULN2003AD  [SO16]  105.4,80.79 90 top
U5  TPS563201DDC  [SOT23-6]  73.91,126 270 top
U6  B1224LS-1WR3  [SIP7_6X19.65_SINGLE]  90.44,17.23 180 bottom
U7  LM293D  [SOIC8]  103.37,32.53 0 top
U8  74LVC1G14DBV  [SOT23-5]  79.77,61.28 0 top
U9  MAX809S  [SOT23B-3]  42.41,160.98 0 top
U10  74LVC1G07GV  [SOT23-5]  73.35,38.07 90 top
U11  TL431  [SOT23B-3]  9.14,22.65 180 top
U12  TL431  [SOT23B-3]  41.14,22.88 180 top
U13  AD8667ARZ-SO8  [SOIC8]  22.34,20.59 180 top
U14  AD8667ARZ-SO8  [SOIC8]  54.35,20.59 180 top
U15  REF3020AIDBZ  [SOT23B-3]  14.22,26.66 0 top
U16  REF3020AIDBZ  [SOT23B-3]  47.16,26.79 0 top
U17  MCP3550  [SOIC8]  14.47,32.02 90 top
U18  MCP3550  [SOIC8]  47.49,32.02 90 top
U19  B0503S-1WR3  [SIP-4]  22.8,41.95 270 bottom
U20  B0503S-1WR3  [SIP-4]  54.5,41.95 270 bottom
U21  ISO7231CDW  [SO-16W]  13.2,41.93 270 top
U22  ISO7231CDW  [SO-16W]  44.7,41.93 270 top
U23  NC  [PSDV_ELF_2]  26.66,43.2 270 top
U24  NC  [PSDV_ELF_2]  58.41,43.2 270 top
U25  NC  [SOT23-6]  33.27,89.17 90 top
U26  SN74AHCT1G125DBVR-SOT23-5  [SOT23-5]  29.96,89.17 270 top
U27  3.3V  [SOT-223]  84.57,138.96 0 top
U28  K78-1000R  [K78XX-1000R3_V]  105.66,65.55 180 top
U29  K78-1000R  [K78XX-1000R3_V]  84.32,116.86 180 top
U30  74LVC1G17  [SOT23-5]  75.3,53.33 270 top
U31  TPS2553DBV  [SOT23-6]  78.63,28.21 90 top
U$1  [LCD12864_93X70_CHINA_SILK]  163,132.2 0 top
U$2  [ART]  120.8,159.85 180 bottom
VR1  S20K275  [S20K420]  214.7,42.99 0 top
X1  PINHEAD_1X04-2.54  [1X04-PTH-2.54]  78.48,105.43 90 top
X2  PINHEAD_1X02-2.54  [1X02-PTH-2.54]  66.79,97.55 90 top
X3  PINHEAD_1X05-2.54  [1X05-PTH-2.54]  227.5,133.75 180 top
X5  PINHEAD_1X03-2.54  [1X03-PTH-2.54]  84.32,6.37 270 bottom
X7  PINHEAD_1X03-2.54  [1X03-PTH-2.54]  44.95,150.64 270 top
X8  PINHEAD_1X03-2.54  [1X03-PTH-2.54]  80.51,163.34 270 top
X9  PINHEAD_1X02-2.54  [1X02-PTH-2.54]  86.1,75.2 0 top
X10  PINHEAD_1X02-2.54  [1X02-PTH-2.54]  86.1,77.74 0 top
X11  WF-3  [KF2510-03]  231.64,101.11 270 top
Z1  25MHz  [OSCILLATOR-3.2X2.5-4P]  70.6,88.66 270 top
Z2  32K  [32X15]  76.47,84.65 0 top

## Tracks (layer width: path | path; a pad name or v marks a point on that pad's centre or on a via)
3V3_EN
  Top 0.254: U5.5 73.91,130.24 74.24,130.57 77.74,130.57 77.92,130.4 77.92,129.07 76.95,128.11 R97.1
!HYP_RST  (via drill 0.51 pad 0.25)
  Top 0.254: v60.03,70.25 60.1,70.19 arc45 60.8,69.89 62.43,69.89 62.42,69.9 U1.29 | R27.1 9.5,71.94 10.84,70.6 arc-45 11.42,69.19 11.42,61.01 arc90 16.02,56.41 42.55,56.41 arc45 44.67,57.29 47.39,60.01 arc45 48.27,62.13 48.27,65.28 v48.25,65.3 48.25,66 arc-45 49.01,67.84 TP17.TP
  Bottom 0.254: v48.25,65.3 48.25,65.4 arc45 48.75,66.6 48.75,67.93 arc-90 51.35,70.53 59.75,70.53 v60.03,70.25
!LCD_RST
  Top 0.254: U1.54 86.81,70.9 arc45 88.23,71.49 92.33,75.59 arc45 93.21,77.71 93.21,115.04 arc-45 94.67,118.58 133.4,157.3 arc-45 136.94,158.77 152.35,158.77 arc45 155.89,160.23 157.02,161.37 arc-45 160.56,162.83 186.91,162.83 arc90 187.91,163.83 CON6.17 187.89,164.77 187.89,168.91 R66.2
!NRST_205
  Top 0.254: C14.2 65.98,89.41 66.4,89.41 arc90 66.8,89.81 66.8,94.75 66.79,94.76 X2.1 | C14.2 66.1,89.21 66.1,88.66 arc45 66.69,87.25 68.37,85.56 68.37,83.86 68.83,83.41 68.83,82.37 69.33,81.86 69.33,80.03 69.32,80.02 U1.7 | C14.2 R4.2
!PH_CS  (via drill 0.51 pad 0.25)
  Top 0.254: v50.03,55.39 50,55.39 arc45 47.88,54.51 46.08,52.71 arc-45 43.96,51.83 17.11,51.83 arc90 15.11,49.83 U21.3 | U1.20 58.32,74.4 arc90 55.62,71.7 55.62,56.55 v56.43,55.74 56.43,54.42 TP11.TP
  Bottom 0.254: v50.03,55.39 56.07,55.39 v56.43,55.74
!RX_CS
  Top 0.254: U1.33 64.82,58.27 arc-90 63.21,56.66 TP22.TP 62.13,56.66 arc45 61.42,56.37 57.26,52.21 arc-45 55.14,51.33 54.58,51.33 arc45 52.45,50.45 50.91,48.9 arc45 50.03,46.78 50.03,45.48 arc-90 49.53,44.98 47.2,44.98 arc-90 46.8,45.38 46.8,46.23 U22.3
+3V3  (via drill 0.5 pad 0.25, 0.51, 0.51 pad 0.25, 0.6 pad 0.25, 0.61 pad 0.25)
  Top 0.254: 74.72,76.47 74.72,75.9 U1.64 | 61.1,75.02 61.22,74.9 U1.19 | 48.76,76.95 48.76,79.95 | 48.76,79.95 48.76,85.46 | 38.85,50.31 38.85,45.58 arc135 41.08,44.66 41.13,44.7 arc45 41.42,45.41 41.42,46.33 U22.7 | U1.13 66.32,79.53 66.13,79.72 | 76.65,135.2 76.45,135.4 v73.4,135.4 | v48,168.67 46.22,168.67 46.22,162.22 46.07,162.07 R81.2 | 48.76,76.95 48.76,74.44 | 48.76,74.44 48.76,72.64 46.54,70.42 arc45 46.25,69.71 46.25,68.89 arc-90 45.75,68.39 45.17,68.39 R85.2 | R13.2 45.17,72.83 46.2,73.85 arc-45 47.61,74.44 48.76,74.44 | 48.76,79.95 48.73,79.98 47.88,79.98 arc-45 46.46,80.56 45.17,81.86 R11.2 | IC2.4 82.92,19.22 arc-90 81.72,20.42 81.72,23.15 arc45 81.28,24.21 80.85,24.65 arc-45 80.41,25.71 80.41,27.38 arc90 79.81,27.98 77.44,27.98 arc-90 76.24,29.18 76.24,30.4 arc90 75.74,30.9 74.97,30.9 arc-90 74.47,31.4 v74.47,33.29 | v35.04,77.21 35.02,77.18 35.02,75.49 R84.2 34.98,75.18 34.98,72.76 R83.2 34.98,72.56 34.98,70.48 R82.2 | 62.2,68.22 62.38,68.4 U1.32 | 72.61,65.98 72.4,65.98 72.4,66.38 U1.48 | 48.76,76.95 45.17,76.95 R12.2 | R94.2 77.32,34.82 | v74.36,44.9 74.36,43.79 R41.2 | 36.3,88 36.17,87.87 U25.6 | U27.2
  Top 0.305: 76.65,135.2 76.95,134.89 R98.1
  Top 0.406: 74.72,76.47 74.92,76.47 v75.18,76.73 C4.1 | v60.65,75.71 60.65,75.48 61.1,75.02 | 46.98,86.63 v46.98,91.2 R9.2 | 46.98,86.63 47.66,86.63 arc-90 48.76,85.53 48.76,85.46 | 46.98,86.63 R10.2 | R21.2 84.57,111.74 84.57,109.53 R20.2 R19.2 | 78.48,112.79 X1.4
  Top 0.5: U10.5 74.3,34.77 | 74.3,34.77 74.3,34.57 C83.1 74.33,33.43 v74.47,33.29 | 77.32,34.82 77.27,34.77 74.3,34.77
  Top 0.508: R19.2 83.38,107.21 arc90 81.58,105.41 81.58,81.31 79.53,79.27 v79.49,79.27 v79.48,79.27 77.22,77 C4.1 | 20.1,49.33 19.37,50.06 C57.1 17.99,48.98 17.64,48.63 U21.1 | 66.13,79.72 64.86,80.99 v64.86,81.09 64.46,81.09 63.54,82.01 63.54,84.45 C7.1 | C1.1 59.4,76.22 | C29.1 36.3,88 v36.3,85.85 | 49.52,52.34 49.48,52.3 C58.1 49.48,49.85 49.14,49.5 U22.1 | U21.7 v10.03,44.21 | U8.5 78.29,60.33 76.58,58.62 74.72,58.62 v74.11,58.01 74.25,57.87 C79.1 74.34,56.6 74.34,54.65 U30.5
  Top 0.61: 62.2,68.22 61.31,67.33 61.31,65.92 | 61.31,65.92 C2.1 | v62.7,66.03 62.59,65.92 61.31,65.92 | R81.2 U9.3
  Top 0.813: 45,168.67 v44.82,168.67 | v74.19,65.98 72.61,65.98 | v74.19,65.98 74.92,65.98 C5.1 | v74.19,65.98 C3.1 | 80,138.94 C78.1
  Top 0.914: 49.27,168.67 49.41,168.81 C61.2 52.07,168.81 52.45,169.19 U2.2
  Top 0.965: 63.49,121.25 63.55,121.19 C75.2 C76.2 69.33,119.53 69,119.2
  Top 1: 58.67,84.65 58.7,84.62 C6.1 63.38,84.62 63.54,84.45
  Top 1.27: U27.2 U27.4 | 56.38,76.22 59.4,76.22 60.14,76.22 v60.65,75.71 | 56.38,76.22 56.38,76.19 55.74,76.19 54.97,75.43 arc45 54.09,73.31 54.09,55.34 arc-90 51.09,52.34 49.52,52.34 48.83,52.34 arc45 46.7,51.46 46.43,51.19 arc-45 44.31,50.31 38.85,50.31 21.07,50.31 20.1,49.33 19.04,48.28 19.04,45.21 arc-90 18.04,44.21 v10.03,44.21 8.02,44.21 arc-90 1.52,50.71 1.52,78.5 2.79,79.77 L4.1 | L10.2 110.23,173.07 arc90 108.53,174.77 92.93,174.77 arc90 88.13,169.97 v88.13,169.18 87.62,169.18 87.37,168.93 | 56.38,76.6 56.38,76.22 | 49.27,168.67 v49.01,168.67 v48,168.67 C60.+ 45,168.67
  Top 1.778: 81.02,116.86 U29.3
  Top 2.032: 56.38,76.6 TP26.TP 56.38,79.8 arc-45 57.26,81.92 57.79,82.45 arc45 58.67,84.57 58.67,84.65 v58.67,91.2 59.17,91.2 | 69,119.2 L2.2
  Top 2.54: 87.37,168.93 87.37,145.56
  Top 3.048: 63.49,112.98 63.49,112.79 78.48,112.79 arc90 81.02,115.33 81.02,116.86 | 63.49,112.98 63.49,121.25 63.49,136.67 | 63.49,112.98 62.34,111.82 arc45 61.46,109.7 61.46,94.73 arc-45 60.58,92.61 59.17,91.2
  Bottom 1.016: 74.92,76.98 v75.18,76.73 | v74.36,44.9 74.36,33.39 v74.47,33.29
  Bottom 1.27: 54.86,168.67 54.86,152.3 arc-45 53.68,149.47 48.92,144.7 arc45 47.74,141.87 47.74,136.13 arc90 49.74,134.13 CON1.1 | v60.65,75.71 62.57,75.71 | 74.92,76.98 74.64,77.26 arc45 72.52,78.14 66.24,78.14 arc45 64.12,77.26 62.57,75.71 | v44.82,168.67 v48,168.67 | 62.57,75.71 62.57,66.17 v62.7,66.03 74.13,66.03 v74.19,65.98 74.24,65.98 75.18,65.04 75.18,59.07 v74.11,58.01 74.11,50.16 74.95,49.32 74.95,46.58 74.36,45.99 v74.36,44.9 | CN13.6 v35.04,77.21 35.04,83.35 arc-45 35.92,85.47 v36.3,85.85 40.78,90.33 arc-45 42.9,91.2 v46.98,91.2 v58.67,91.2 v59.94,91.2
  Bottom 1.524: v48,168.67 54.86,168.67 74.92,168.67 75.43,169.18 v86.61,169.18 v88.13,169.18
  other vias: 64,139.97 73.4,139.97 83.56,147.59 82.29,144.8 84.52,144.8 86.81,144.8 84.52,142.77 82.24,139.72 84.52,139.72 86.81,139.72 83.05,142.77 86.1,142.77 84.57,141.45 86.1,141.45 83.05,141.45 88.08,147.59 68.57,139.97 64,135.4 68.57,135.4 77.97,139.97 77.97,144.29
  pour Top (isolate 0.254, no thermals): 64.51,141.5 74.16,141.5 81.02,148.35 88.89,148.35 88.89,137.94 78.48,137.94 78.48,134.38 62.07,134.38 62.07,139.06
  pour Bottom (isolate 0.254): 64.51,141.5 74.16,141.5 81.02,148.35 88.89,148.35 88.89,137.94 78.48,137.94 78.48,134.38 61.97,134.38 61.97,138.96
+5V  (via drill 0.5, 0.5 pad 0.25, 0.5 pad 0.8, 0.51, 0.51 pad 0.25, 0.6, 0.6 pad 0.25)
  Top 0.254: HL3.4 16.59,111.7 16.59,110.02 C93.1 16.77,109.85 14.47,109.85 | C95.1 16.69,58.54 16.69,60.28 16.67,60.3 HL5.4 | 116.77,31.45 C102.1 116.62,31.64 116.62,33.3 HL12.4 | C103.1 116.64,24.12 116.64,25.8 HL13.4 | HL11.4 116.64,40.8 116.64,39.23 C101.1 | HL10.4 116.59,48.3 116.59,46.78 C100.1 | HL9.4 116.62,55.8 116.62,54.27 C99.1 | C98.1 116.62,61.71 116.62,63.3 HL8.4 | U5.3 75.29,125.14 76.81,125.14 R97.2 | R106.1 73.74,29.61 73.52,29.4 73.52,27.26 arc45 73.82,26.55 74.73,25.63 R44.2 74.73,25.47 75.13,25.08 arc-45 75.42,24.37 C27.1 | R35.2 81.75,28.21 81.63,28.1 | R103.2 78.44,48.79 77.98,48.33 arc45 77.69,47.62 77.69,42.67 Q4.2 | HL6.4 116.6,78.3 116.6,76.64 C96.1 | R64.2 68.65,43.4 v67.8,42.55
  Top 0.3: HL15.4 116.62,85.8 116.62,84.24 C105.1 | HL2.4 16.69,131.7 16.69,129.53 C92.1 | HL1.4 16.59,151.69 16.59,149.95 C91.1 | C104.1 116.59,91.73 116.59,93.3 HL14.4
  Top 0.305: 114.8,68.85 C97.1 116.57,69.05 116.57,70.8 HL7.4 | HL16.4 214.65,145.29 214.65,143.67 C106.1 211.32,143.53 | C94.1 16.64,78.4 16.64,80.29 HL4.4
  Top 0.406: U25.1 34.22,91.24 arc90 33.72,91.74 29.5,91.74 arc90 29,91.24 29,90.49 U26.5 29.01,90.07 27.52,90.07 arc45 27.17,89.93 27.14,89.9 C30.1 25.94,89.9 25.8,90.04 | BZ1.B+ 94.1,169.11 arc-45 95.52,169.7 103.81,169.7 R31.2 104,172.36 103.88,172.48
  Top 0.508: 114.8,54.17 114.85,54.12 C99.1 | 114.8,61.59 114.83,61.56 C98.1 | 14.47,78.25 C94.1 | v14.98,58.44 C95.1 | v79.57,33.6 79.6,33.57 79.6,32.25 | C80.1 79.57,32.28 79.6,32.25 | U31.1 79.6,29.53 79.6,32.25
  Top 0.6: Q4.2 77.98,42.36 v76.72,42.36
  Top 0.61: 14.47,129.3 14.47,109.85 14.47,78.25 13.28,77.06 arc45 12.69,75.64 12.69,60.44 arc90 14.69,58.44 v14.98,58.44 | 114.8,76.5 114.8,84.09 | 114.8,84.09 114.8,90.7 115.64,91.53 C104.1 | 14.47,129.3 14.47,132.54 arc-45 15.06,133.95 19.95,138.85 arc90 19.95,145.47 17.76,147.66 arc45 16.69,148.1 15.98,148.1 arc-90 14.98,149.1 14.98,149.62 | 14.98,149.62 14.98,153.02 arc-90 17.68,155.72 21.42,155.72 arc-90 24.12,153.02 24.12,92.95 arc45 25,90.83 25.8,90.04 | 114.8,46.6 114.8,54.17 114.8,61.59 114.8,68.85 v114.8,70.12 114.8,76.5 | 114.8,46.6 114.8,39.11 | 114.8,31.45 114.8,39.11 | 114.8,31.45 114.8,24.96 115.74,24.02 C103.1 | 14.47,129.3 14.6,129.43 C92.1 | 14.98,149.62 15.11,149.75 C91.1 | 114.8,31.45 116.77,31.45 | 114.8,39.11 114.83,39.08 C101.1 | 114.8,84.09 C105.1 | 114.8,46.6 116.72,46.6 C100.1 | 114.8,76.5 C96.1
  Top 0.65: U5.3 74.86,122.28 C73.P$2
  Top 0.813: R67.2 193.58,171.24 arc-45 197.82,172.99 203.5,172.99 arc-45 207.74,171.24 224.55,154.43 arc-45 226.31,150.19 226.31,145.36 arc45 228.06,141.12 233.19,136 arc-45 234.94,131.75 234.94,127.85 arc45 235.53,126.43 236.64,125.32 arc-45 237.23,123.9 237.23,102.37 arc-90 233.43,98.57 X11.1 | v113.53,70.12 v114.8,70.12 | v81.6,27.07 81.63,27.09 81.63,28.1 | U27.3 86.87,132.84 C77.1 | R45.1 v79.24,22.65 78.5,23.39 C27.1 75.44,23.36 75.44,21.08 D4.2 | R63.2 37.22,44.72 v35.2,44.72
  Top 0.965: v76.95,11.7 L3.1
  Top 1: L13.2 U28.3 | U27.3 90.26,135.81 90.92,135.15
  Top 1.016: v75.68,11.7 v76.95,11.7
  Top 1.27: v102.1,114.57 137.97,150.45 arc-45 141.51,151.91 203.95,151.91 211.32,144.54 211.32,143.53 211.32,120.74 arc45 212.78,117.2 231.42,98.57 X11.1 | 90.29,135.15 90.92,135.15 90.92,168.58 arc-90 94.82,172.48 103.88,172.48 107.42,172.48 L9.2
  Top 1.778: 87.11,121.68 C73.P$2
  Top 2.032: U28.3 103.12,65.8 102.81,66.11 | 87.11,117.11 U29.1
  Top 2.54: 90.29,135.15 90.29,126.26 87.11,123.08 87.11,121.68 87.11,117.11 87.37,116.86 v88.64,116.86 | v102.1,114.57 v102.1,113.3 102.1,108.01 arc-45 100.64,104.47 98.89,102.73 arc45 97.43,99.19 TP25.TP 97.43,73.22 98.19,72.46 C72.+ v101.34,70.12 | v101.34,70.12 v102.61,70.12 102.81,69.92 102.81,66.11 | v101.34,70.12 v100.07,70.12
  Bottom 0.254: 67.81,41.65 v67.81,42.54 v67.8,42.55
  Bottom 0.813: v81.6,27.07 79.88,27.07 79.75,26.94 | v79.57,33.6 79.7,33.6 79.75,33.55
  Bottom 1.016: v76.72,42.36 78.73,42.36
  Bottom 1.524: 76.95,20.34 70.81,20.34 arc-90 67.81,23.34 67.81,41.65 arc135 54.5,47.17 52.94,45.6 arc-45 50.82,44.72 v35.2,44.72 31.21,44.72 arc-45 29.08,45.6 27.73,46.96 arc90 22.5,46.96 21.14,45.6 arc-45 19.02,44.72 15.62,44.72 arc-135 13.05,50.92 13.4,51.27 arc45 14.98,55.09 v14.98,58.44 14.98,59.04 arc-135 20.12,61.17 24.28,57.01 arc135 32.5,60.42 CN13.3
  Bottom 2.032: v114.8,70.12 v100.07,70.12 96.96,67.01 arc-45 93.42,65.55 88.68,65.55 arc45 85.14,64.09 80.45,59.39 arc45 78.99,55.86 78.99,42.49 78.86,42.49 78.73,42.36 79.75,41.34 79.75,33.55 79.75,26.94 79.75,23.16 v79.24,22.65 76.95,20.36 76.95,20.34 v76.95,11.7 v75.68,11.7 | 87.11,116.86 U29.1
  Bottom 2.54: 87.11,116.86 99.81,116.86 v102.1,114.57 v102.1,113.3
+12V  (via drill 0.5, 0.6)
  Top 0.254: 82.54,45.69 82.41,45.56 R105.2 | L14.P$2 86.33,35.1
  Top 0.305: 82.75,47.52 82.54,47.72
  Top 0.508: R89.1 82.75,47.52 | IC1.2 87.27,49.42 arc-45 86.21,49.86 85.79,50.28 C63.P$2
  Top 0.61: U3.9 109.85,85.23 | K1.2 123.12,85.52 arc-45 121.66,89.05 121.66,93.96 arc-45 123.12,97.49 127.97,102.34 127.97,102.42 | U6.1 82.94,17.12 C89.1
  Top 0.813: 109.85,85.23 110.48,85.87 112.26,85.87
  Top 1.27: U28.1 108.45,65.55 108.7,65.3 | 86.33,35.1 86.22,35.2
  Top 1.524: v88.13,40.4 88.13,41.95 arc90 86.63,43.45 84.04,43.45 arc-90 82.54,44.95 82.54,45.69 82.54,47.72 C64.P$2 C63.P$2
  Top 2.54: v140.2,90.7 v138.93,90.7 v137.66,90.7 v136.39,90.7 136.39,94 127.97,102.42 126.7,103.69 arc135 112.26,97.71 112.26,85.87 112.26,73.93 108.7,70.38 108.7,65.3 108.7,60.73 arc-45 107.83,58.61 106.72,57.5 arc45 105.84,55.38 105.84,44.37 arc-90 103.14,41.67 94.17,41.67 arc45 92.05,40.8 91.66,40.4 C59.+ v88.13,40.4 88.13,38.19 86.22,36.29 86.22,35.2 86.22,33.6 87.42,32.4 D8.C
  Bottom 0.508: v88.13,40.4 88.13,40.39 86.75,39 arc45 85.28,35.47 85.28,21.67 arc-45 83.82,18.14 82.91,17.23 U6.1
  Bottom 0.61: 175.76,90.7 175.76,84.42 arc45 176.64,82.29 K4.2 | K5.2 193.4,82.29 arc-45 192.52,84.42 192.52,90.7 | 159,90.7 159,84.42 arc45 159.88,82.29 K3.2 | 142.23,90.7 142.23,84.42 arc45 143.11,82.29 K2.2
  Bottom 1.016: 218.43,90.7 219.92,90.7 arc-90 224.02,86.6 224.02,83.35 K7.C2
  Bottom 2.54: 218.43,90.7 192.52,90.7 175.76,90.7 159,90.7 142.23,90.7 v140.2,90.7 v136.39,90.7
AC_L  (via drill 1)
  Top 2.54: 236.47,9.67 236.52,9.67 CN1.1
  Top 5.08: v235.7,22.37 235.7,16.78 236.47,16.02 236.47,9.67
  Bottom 2.54: 184.14,77.49 K4.1 | 200.91,77.74 K5.1 | 167.38,77.74 K3.1 | 150.61,76.73 K2.1 | K1.1 133.85,79.46
  Bottom 3.81: 200.65,74.19 213.35,74.19 214.88,75.71 | 200.65,74.19 184.14,74.19 | 184.14,74.19 167.38,74.19 | 167.38,74.19 150.61,74.19 | 150.61,74.19 139.13,74.19 133.85,79.46 | 150.61,74.19 150.61,76.73 | 167.38,74.19 167.38,77.74 | 184.14,74.19 184.14,77.49 | 200.91,77.74 200.91,74.44 200.65,74.19
  Bottom 5.08: 214.88,75.71 228.08,75.71
  other vias: 235.7,27.45 239.01,41.93 239.01,36.85 239.01,31.51 235.96,48.79 228.59,60.47 233.42,60.47 228.59,68.09 230.37,51.58 228.59,75.96 235.96,54.12 234.69,75.96
  pour Bottom (no thermals): 224.02,78.12 241.29,78.12 242.05,77.49 241.8,64.53 237.99,60.72 237.99,49.55 242.82,44.72 242.82,29.99 238.12,25.29 238.12,21.61 234.94,21.61 232.15,24.4 232.15,29.23 235.2,32.28 235.2,41.17 226.56,49.8 226.56,71.65 224.02,74.19
  pour Top (no thermals): 226.56,78.12 241.29,78.12 242.05,77.49 241.8,64.53 237.99,60.72 237.99,49.55 242.82,44.72 242.82,29.99 238.12,25.29 238.12,16.53 232.91,16.53 230.37,19.07 230.37,27.45 235.2,32.28 235.2,41.17 226.56,49.8
AC_N
  Top 2: CON4.2.2 CON4.1.2
  Bottom 2: CN4.1.2 CN4.2.2 143,17.95 142.5,18.45
  Bottom 2.032: CN1.2 230.12,8.65 | 222.75,24.15 222.75,24.61 CN2.5
  Bottom 2.54: 230.12,8.65 230.12,9.67
  Bottom 3.048: 171.95,22.88 171.65,22.58 171.65,18 CON4.2.2 | 199.64,22.12 199.38,21.86 CON3.2.2 CON3.1.2
  Bottom 5.08: 230.12,9.67 230.12,14.5 227.58,17.04 222.75,17.04 | 199.64,26.18 171.95,26.18 | 171.95,26.18 144.77,26.18 142.5,23.91 142.5,18.45 | 199.64,26.18 199.64,22.12 | 199.64,26.18 208.27,26.18 217.42,17.04 222.75,17.04 | 171.95,26.18 171.95,22.88 | 222.75,24.15 222.75,17.04
ADC_IN  (via drill 0.5, 0.51 pad 0.25)
  Top 0.254: v67.81,75.71 67.32,76.2 U1.11 67.32,80.59 66.08,81.83 66.08,82.72 v65.58,83.23 65.58,84.53 C107.2 | v50.94,85.87 50.94,85.81 51.3,85.45 51.3,71.68 arc-90 50.3,70.68 49.48,70.68 R113.1
  Bottom 0.254: v67.81,75.71 68.56,74.96 arc45 70.69,74.08 82.47,74.08 arc45 84.6,74.96 84.83,75.19 X9.1 | v65.58,83.23 65.58,83.28 65.09,83.76 arc45 63.68,84.35 60.76,84.35 arc-45 59.35,84.93 59.2,85.08 arc45 57.78,85.67 51.14,85.67 v50.94,85.87
BOOT0_205  (via drill 0.51 pad 0.25)
  Top 0.254: v52.65,102.89 arc-45 52.32,103.69 52.32,113.08 arc-45 53.19,115.2 53.47,115.47 arc45 54.35,117.59 54.35,125.52 arc45 53.47,127.64 48.17,132.94 arc-45 47.29,135.06 47.29,140.81 47.08,141.03 R5.2 | v78.12,98.47 78.12,97.19 R3.2 78.46,96.85 78.46,96.64 80.31,94.8 arc-45 80.89,93.38 80.89,82.44 76.19,77.74 74.9,77.74 73.27,76.12 73.27,74.13 73.5,73.9 U1.60
  Bottom 0.254: v78.12,98.47 78.09,98.43 73.49,98.43 arc-45 72.08,99.02 71.08,100.02 arc45 69.67,100.6 55.76,100.6 arc-45 54.35,101.19 v52.65,102.89
BTN_AUTO  (via drill 0.51 pad 0.25)
  Top 0.254: v61.71,79.77 63.14,79.77 63.82,79.09 64.31,79.09 64.82,78.57 U1.16 | C15.1 v46.6,84.35 46.6,84.74 arc90 45.8,85.54 44.94,85.54 arc-90 44.44,86.04 44.44,87.63 arc-45 44.73,88.34 45.07,88.67 45.07,88.82 R14.1
  Bottom 0.254: v61.71,79.77 52,79.77 arc-45 50.59,80.36 v46.6,84.35
BTN_BACKWASH  (via drill 0.51 pad 0.25)
  Top 0.254: v60.61,71.54 60.67,71.61 arc-45 61.38,71.9 U1.25 | R18.1 45.17,70.52 46.6,71.96 v46.6,72.66 46.89,72.95 48.03,72.95 C19.1
  Bottom 0.254: v46.6,72.66 47.25,72.02 arc45 49.37,71.14 60.2,71.14 v60.61,71.54
BTN_HEATER  (via drill 0.51 pad 0.25)
  Top 0.254: U1.24 60.28,72.4 arc45 59.57,72.11 v59.49,72.03 | R17.1 45.17,75.25 46.12,75.25 v46.6,75.73 C18.1
  Bottom 0.254: v59.49,72.03 59.21,71.75 51.72,71.75 arc-45 49.84,72.53 46.63,75.73 v46.6,75.73
BTN_MANUAL  (via drill 0.51 pad 0.25)
  Top 0.254: v60.75,78.77 61.05,78.77 62.42,77.39 62.42,75.9 U1.17 | v47.9,80.81 48.03,80.95 C16.1 48.03,82.36 47.91,82.36 arc-45 46.49,82.95 45.31,84.13 45.31,84.21 R15.1
  Bottom 0.254: v60.75,78.77 60.25,79.27 50.27,79.27 arc-45 48.86,79.85 v47.9,80.81
BTN_OFF  (via drill 0.51 pad 0.25)
  Top 0.254: U1.23 59.13,72.9 arc45 58.42,72.61 v58.3,72.48 | v47.87,77.69 48.01,77.83 C17.1 48.01,79.26 46.16,79.26 arc-45 45.17,79.67 R16.1
  Bottom 0.254: v58.3,72.48 58.22,72.55 54.27,72.55 arc-45 52.15,73.43 47.89,77.69 v47.87,77.69
BUZZER_PWM  (via drill 0.51, 0.51 pad 0.25)
  Top 0.254: U1.56 81.13,71.9 arc45 82.55,72.49 v83.05,72.99 | Q1.1 92.7,152.01 92.7,120.82 arc-45 92.06,119.26 arc45 91.18,117.14 91.18,83.55 arc-45 90.88,82.84 90.85,82.81 arc90 90.85,81.4 91.41,80.84 arc-45 91.7,80.14 91.7,78.08 arc-45 91.11,76.66 88.56,74.11 arc-45 87.21,73.55 v86.1,73.55 | v92.65,74.72 arc45 91.87,74.4 88.36,70.89 arc-45 86.95,70.3 85.99,70.3 arc45 84.57,69.71 81.52,66.66 arc45 81.22,65.95 arc-45 80.63,64.53 80.31,64.2 arc45 79.72,62.79 79.72,57.89 arc45 80.1,56.96 Q3.1 80.41,56.65 80.41,54.35 arc-45 80.12,53.64 79.46,52.98 arc45 79.16,52.27 79.16,48.69 arc-45 78.87,47.98 78.56,47.67 arc45 78.27,46.97 78.27,44.35 arc45 78.56,43.65 78.64,43.57 arc-45 78.94,42.86 78.94,41.77 arc90 79.44,41.27 79.45,41.27 arc-90 79.95,40.77 79.95,38.78 arc-45 79.81,38.43 79.79,38.42 arc45 79.65,38.06 79.65,36.58 arc-45 79.35,35.88 78.87,35.4 78.87,35.22 R94.1 78.71,35.06 78.71,32.14 arc-45 78.27,31.08 78.1,30.91 arc45 77.66,29.85 77.66,29.53 U31.3
  Bottom 0.254: v83.05,72.99 arc-45 84.4,73.55 v86.1,73.55 90.28,73.55 arc45 92.4,74.43 92.65,74.68 v92.65,74.72
ENC_A  (via drill 0.51 pad 0.25)
  Top 0.254: v96.26,111.42 96.43,111.6 arc45 97.02,113.01 97.02,114.79 arc-45 98.48,118.32 134.93,154.76 arc-45 138.46,156.23 210.56,156.23 219.45,147.34 219.45,145.25 230.01,134.69 230.01,133.78 X3.2 230.04,130.49 ENC1.A | R19.1 86.2,107.07 v86.2,105.94 85.34,105.07 85.34,103.21 arc45 85.63,102.5 86.06,102.07 R24.2 86.06,101.67 85.63,101.24 arc45 85.34,100.53 85.34,99.11 arc45 85.63,98.4 85.77,98.27 arc-45 86.06,97.56 R25.2 C25.1
  Bottom 0.254: v86.2,105.94 86.2,108.85 arc-90 88.2,110.85 95.69,110.85 v96.26,111.42
ENC_B  (via drill 0.51 pad 0.25)
  Top 0.254: v97.27,110.51 arc45 97.53,111.12 97.53,114.53 arc-45 98.99,118.07 135.18,154.26 arc-45 138.72,155.72 210.3,155.72 218.94,147.08 218.94,145.06 224.96,139.04 X3.4 224.96,130.49 ENC1.B | 87.5,104.16 87.5,99.33 C24.1 R26.2 | 87.5,104.16 v87.5,109.49 R20.1 | 87.5,104.16 R23.2
  Bottom 0.254: v97.27,110.51 96.96,110.19 arc-45 95.55,109.61 87.6,109.61 87.5,109.5 v87.5,109.49
ENC_BTN  (via drill 0.51 pad 0.25)
  Top 0.254: v71.01,75.79 71.01,76.24 71.82,77.06 U1.2 | R110.1 86.16,85.44 86.16,83.51 R22.1 86.14,83.13 86.14,81.22 C20.1 85.76,80.84 85.76,80.13 arc-45 85.47,79.42 85.12,79.08 arc45 84.83,78.37 X10.1
  Bottom 0.254: v71.01,75.79 71.02,75.77 arc45 73.15,74.89 80.81,74.89 arc45 82.94,75.77 84.83,77.67 X10.1
ENC_CLK
  Top 0.254: U1.58 78.6,72.9 arc45 81.01,73.9 83.29,76.18 arc-45 84,76.47 85.1,76.47 arc90 86.1,77.47 86.1,78.6 arc-45 86.39,79.31 86.77,79.68 arc45 87.06,80.39 87.06,83.99 87.22,84.14 87.22,91.17 arc90 86.22,92.17 86.06,92.17 C21.1 R111.1 85.96,94.86 85.96,95.3 arc45 85.67,96 85.63,96.04 arc-45 85.34,96.75 85.34,97.34 arc45 85.04,98.05 84.9,98.19 arc-45 84.61,98.9 R26.1 R24.1
ENC_DT
  Top 0.254: U1.59 78.66,73.4 arc45 80.48,74.16 83.27,76.94 arc45 83.56,77.65 83.56,77.99 arc-45 83.85,78.7 84.94,79.79 arc45 85.23,80.49 85.23,84.73 85.34,84.83 85.34,86.69 arc-45 85.63,87.39 85.86,87.63 85.86,87.7 C22.1 R112.1 85.96,90.29 85.96,90.39 85.63,90.72 arc-45 85.34,91.42 85.34,94.98 arc45 85.04,95.69 arc-45 84.79,96.3 84.79,96.87 R25.1 84.51,97.15 84.51,97.29 83.88,97.93 arc-45 83.58,98.64 83.58,102.86 arc-90 84.58,103.86 84.61,103.86 R23.1
ENC_SW  (via drill 0.51 pad 0.25)
  Top 0.254: v95.98,112.77 arc45 96.51,114.06 96.51,115.04 arc-45 97.98,118.58 134.67,155.27 arc-45 138.21,156.74 210.81,156.74 219.96,147.59 219.96,146.38 X3.1 232.58,129.23 230,126.65 ENC1.1 | R21.1 v87.88,111.78 87.88,111.76 88.09,111.55 arc-45 88.38,110.84 88.38,101.24 arc45 88.68,100.53 88.85,100.36 arc-45 89.15,99.65 89.15,96.75 arc-45 88.85,96.04 88.71,95.9 arc45 88.42,95.2 C23.1 88.42,84.12 87.79,83.48 R22.2
  Bottom 0.254: v87.88,111.78 94.16,111.78 arc45 95.57,112.36 v95.98,112.77
ESP32_EN  (via drill 0.51 pad 0.25)
  Top 0.254: v66.95,82.16 66.95,81.91 67.82,81.03 U1.10 | v49.78,87.9 49.73,87.95 arc-45 49.27,89.07 49.27,123.74 arc45 48.39,125.87 44.31,129.95 arc-45 43.43,132.07 43.43,140.26 arc90 R39.1
  Bottom 0.254: v66.95,82.16 67.37,82.59 arc90 67.37,84 66.47,84.9 arc45 65.05,85.49 61.3,85.49 arc-45 59.88,86.08 59.2,86.76 arc45 57.79,87.34 50.34,87.34 v49.78,87.9
ESP32_IO0  (via drill 0.51 pad 0.25)
  Top 0.254: 74.67,152.93 74.67,148.75 arc-45 73.67,146.34 73.26,145.93 arc-45 71.14,145.05 64.17,145.05 arc90 58.67,139.55 58.67,115.81 arc-45 57.79,113.69 57.26,113.17 arc45 56.18,110.56 56.18,103.08 arc-45 55.89,102.37 55.66,102.14 arc45 55.36,101.44 55.36,87.84 arc-45 54.98,86.92 v54.98,86.49 | v66.74,83.43 67.25,83.43 67.81,82.87 67.81,81.83 68.32,81.32 U1.9 | TP21.TP 74.67,152.93 | 74.67,152.93 73.94,153.65 arc45 73.23,153.94 U2.25
  Bottom 0.254: v54.98,86.49 57.86,86.49 arc-45 59.27,85.9 59.63,85.54 arc45 61.05,84.95 64.25,84.95 arc-45 65.91,84.27 v66.74,83.43
ESP32_IO32  (via drill 0.51 pad 0.25)
  Top 0.254: v52.06,67.07 52.06,67.08 52.32,67.34 52.32,86.15 arc45 51.44,88.27 51.16,88.55 arc-45 50.28,90.67 50.28,124.25 arc45 49.41,126.37 45.32,130.46 arc-45 44.44,132.58 44.44,142.81 arc45 44.15,143.52 43.97,143.7 arc-45 43.68,144.4 43.68,148.07 arc-90 44.98,149.37 45.05,149.37 arc135 46.13,152 X7.1 44.95,153.88 arc-45 45.54,155.29 49.1,158.86 arc-45 49.81,159.15 50.5,159.15 arc45 51.21,159.44 53.33,161.56 U2.8 | v69.08,62.76 69.82,63.5 U1.43